# Altium schematic sheet POWER_TS.SchDoc
size A3
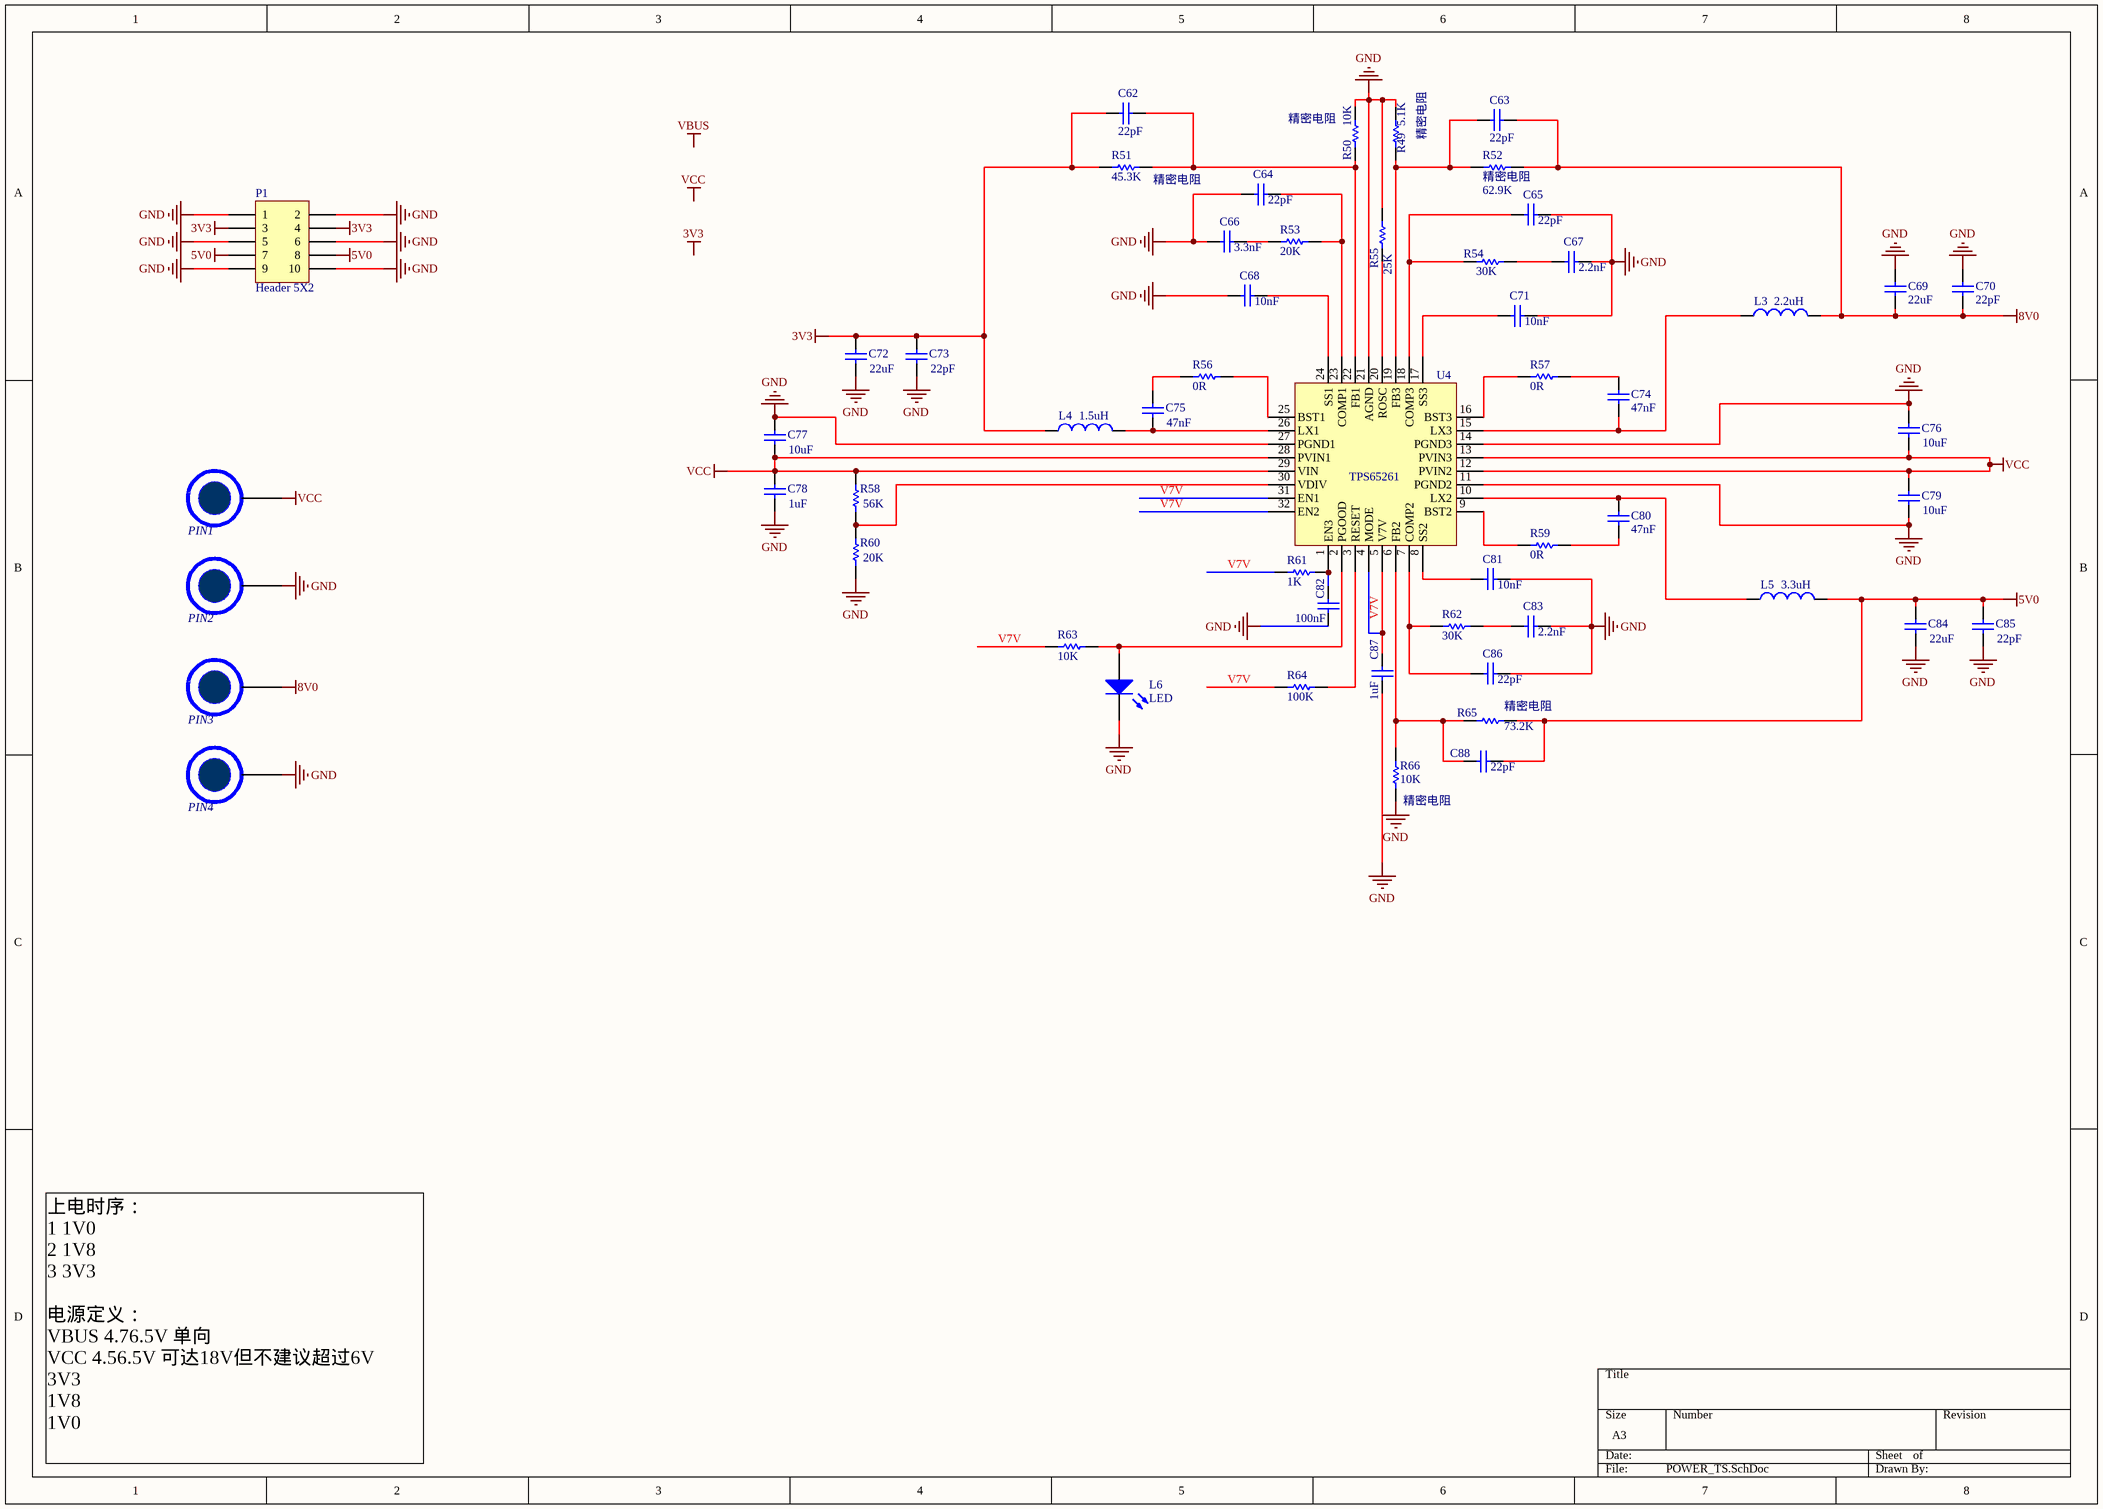
[diagram p0: POWER_TS.SchDoc]

## Parts
C62  value 22pF  [0402]  (hidden comment: Cap)
C63  value 22pF  [0402]  (hidden comment: Cap)
C64  value 22pF  [0402]  (hidden comment: Cap)
C65  value 22pF  [0402]  (hidden comment: Cap)
C66  value 3.3nF  [0402]  (hidden comment: Cap)
C67  value 2.2nF  [0402]  (hidden comment: Cap)
C68  value 10nF  [0402]  (hidden comment: Cap)
C69  value 22uF  [1206]  (hidden comment: Cap)
C70  value 22pF  [0402]  (hidden comment: Cap)
C71  value 10nF  [0402]  (hidden comment: Cap)
C72  value 22uF  [1206]  (hidden comment: Cap)
C73  value 22pF  [0402]  (hidden comment: Cap)
C74  value 47nF  [0402]  (hidden comment: Cap)
C75  value 47nF  [0402]  (hidden comment: Cap)
C76  value 10uF  [1206]  (hidden comment: Cap)
C77  value 10uF  [1206]  (hidden comment: Cap)
C78  value 1uF  [1608[0603]]  (hidden comment: Cap)
C79  value 10uF  [1206]  (hidden comment: Cap)
C80  value 47nF  [0402]  (hidden comment: Cap)
C81  value 10nF  [0402]  (hidden comment: Cap)
C82  value 100nF  [0402]  (hidden comment: Cap)
C83  value 2.2nF  [0402]  (hidden comment: Cap)
C84  value 22uF  [1206]  (hidden comment: Cap)
C85  value 22pF  [0402]  (hidden comment: Cap)
C86  value 22pF  [0402]  (hidden comment: Cap)
C87  value 1uF  [1608[0603]]  (hidden comment: Cap)
C88  value 22pF  [0402]  (hidden comment: Cap)
L3  value 2.2uH  [2220]  (hidden comment: Inductor)
L4  value 1.5uH  [C2012]  (hidden comment: Inductor)
L5  value 3.3uH  [C2012]  (hidden comment: Inductor)
L6  LED  [1608[0603]]
P1  Header 5X2  [HDR2X5]
PIN1  PIN  [PIN]  (value not drawn)
PIN2  PIN  [PIN]  (value not drawn)
PIN3  PIN  [PIN]  (value not drawn)
PIN4  PIN  [PIN]  (value not drawn)
R49  精密电阻  value 5.1K  [1608[0603]]
R50  精密电阻  value 10K  [1608[0603]]
R51  精密电阻  value 45.3K  [R2012]
R52  精密电阻  value 62.9K  [R2012]
R53  value 20K  [0402]  (hidden comment: Res)
R54  value 30K  [0402]  (hidden comment: Res)
R55  value 25K  [0402]  (hidden comment: Res)
R56  value 0R  [0402]  (hidden comment: Res)
R57  value 0R  [0402]  (hidden comment: Res)
R58  value 56K  [0402]  (hidden comment: Res)
R59  value 0R  [0402]  (hidden comment: Res)
R60  value 20K  [0402]  (hidden comment: Res)
R61  value 1K  [0402]  (hidden comment: Res)
R62  value 30K  [0402]  (hidden comment: Res)
R63  value 10K  [0402]  (hidden comment: Res)
R64  value 100K  [0402]  (hidden comment: Res)
R65  精密电阻  value 73.2K  [1608[0603]]
R66  精密电阻  value 10K  [1608[0603]]
U4  TPS65261  [QFN50P500X500X100_HS-33N]

## Nets
3V3: C62.2 C72.2 C73.2 L4.1 P1.3 P1.4 R51.2
5V0: C84.2 C85.2 C88.2 L5.2 P1.7 P1.8 R65.1
8V0: C63.1 C69.2 C70.2 L3.2 PIN3.1(PIN) R52.1
GND: C64.1 C65.2 C66.1 C67.2 C68.1 C69.1 C70.1 C71.2 C72.1 C73.1 C76.2 C77.2 C78.1 C79.1 C81.1 C82.1 C83.1 C84.1 C85.1 C86.2 C87.1 L6.2(K) P1.1 P1.2 P1.5 P1.6 P1.9 P1.10 PIN2.1(PIN) PIN4.1(PIN) R49.1 R50.1 R55.2 R60.1 R66.1 U4.11(PGND2) U4.14(PGND3) U4.21(AGND) U4.27(PGND1)
VCC: C76.1 C77.1 C78.2 C79.2 PIN1.1(PIN) R58.2 U4.12(PVIN2) U4.13(PVIN3) U4.28(PVIN1) U4.29(VIN)
V7V: C87.2 R61.1 R63.2 R64.2 U4.4(MODE) U4.5(V7V) U4.31(EN1) U4.32(EN2)
NetC62_1: C62.1 R50.2 R51.1 U4.22(FB1)
NetC63_2: C63.2 R49.2 R52.2 U4.19(FB3)
NetC64_2: C64.2 R53.2 U4.23(COMP1)
NetC65_1: C65.1 R54.1 U4.18(COMP3)
NetC66_2: C66.2 R53.1
NetC67_1: C67.1 R54.2
NetC68_2: C68.2 U4.24(SS1)
NetC71_1: C71.1 U4.17(SS3)
NetC74_1: C74.1 R57.1
NetC74_2: C74.2 L3.1 U4.15(LX3)
NetC75_1: C75.1 L4.2 U4.26(LX1)
NetC75_2: C75.2 R56.2
NetC80_1: C80.1 L5.1 U4.10(LX2)
NetC80_2: C80.2 R59.1
NetC81_2: C81.2 U4.8(SS2)
NetC82_2: C82.2 R61.2 U4.1(EN3)
NetC83_2: C83.2 R62.2
NetC86_1: C86.1 R62.1 U4.7(COMP2)
NetC88_1: C88.1 R65.2 R66.2 U4.6(FB2)
NetL6_1: L6.1(A) R63.1 U4.2(PGOOD)
NetR55_1: R55.1 U4.20(ROSC)
NetR56_1: R56.1 U4.25(BST1)
NetR57_2: R57.2 U4.16(BST3)
NetR58_1: R58.1 R60.2 U4.30(VDIV)
NetR59_2: R59.2 U4.9(BST2)
NetR64_1: R64.1 U4.3(RESET)

## Notes on the sheet
- 上电时序：
  1 1V0
  2 1V8
  3 3V3
  电源定义：
  VBUS 4.76.5V 单向
  VCC 4.56.5V 可达18V但不建议超过6V
  3V3
  1V8
  1V0
- Labels drawn without touching a wire or pin: 3V3, VBUS, VCC

## Library data of the parts
C62-C88 = Cap: 贴片电容; Published: 8-Jun-2000; LatestRevisionDate: 17-Jul-2002; LatestRevisionNote: Re-released for DXP Platform.; PackageReference: RAD-0.3; Publisher: Altium Limited
L3-L5 = Inductor: Code_IEC: 1005; Published: 8-Jun-2000; LatestRevisionDate: 29-May-2009; LatestRevisionNote: IPC-7351 Footprint Added.; PackageReference: 0402-A; Publisher: Altium Limited; PackageDescription: Chip Inductor; Code_JEITA: 0402
P1 = Header 5X2: Header, 5-Pin, Dual row; LatestRevisionDate: 17-Jul-2002; LatestRevisionNote: Re-released for DXP Platform.; Publisher: Altium Limited
R49-R66 = Res: 贴片电阻; Published: 8-Jun-2000; LatestRevisionDate: 17-Jul-2002; LatestRevisionNote: Re-released for DXP Platform.; PackageReference: AXIAL-0.3; Publisher: Altium Limited